# Altium project My_First_PCB_Project.PrjPcb (part 1 of 4)
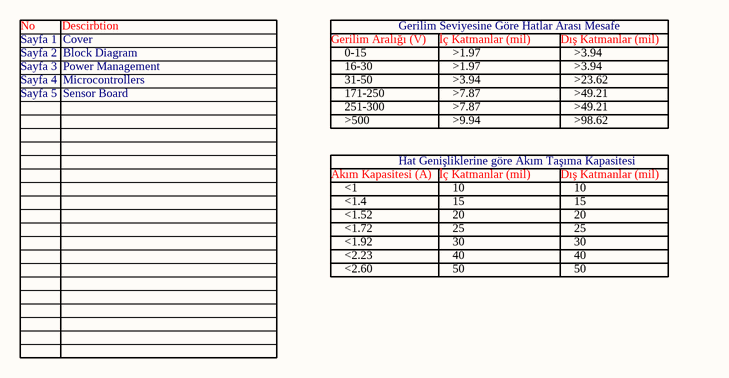
[diagram p0: Cover.SchDoc]
5 sheets, 126 parts. Net scope: flat (ports and power ports of the same name join across sheets).
Board file: Myfirstpcbproject.PcbDoc
Sheets:
  Cover.SchDoc
  Block_Diagram.SchDoc
  Power management.SchDoc
  Microcontrollerr.SchDoc
  Sensor Board.SchDoc

## Sheet Cover.SchDoc
size A4; SheetNumber: 1; SheetTotal: 5

### Notes on the sheet
- Sayfa 1  Cover
- No         Descirbtion
- Gerilim Aralığı (V)
- Gerilim Seviyesine Göre Hatlar Arası Mesafe
- İç Katmanlar (mil)
- Dış Katmanlar (mil)
- Sayfa 2  Block Diagram
- Sayfa 3  Power Management
- Sayfa 4  Microcontrollers
- Sayfa 5  Sensor Board
- 0-15
- 16-30
- 31-50
- 171-250
- 251-300
- >7.87
- >3.94
- >1.97
- >23.62
- >49.21
- Akım Kapasitesi (A)
- >500
- Hat Genişliklerine göre Akım Taşıma Kapasitesi
- >9.94
- >98.62
- <1
- <1.4
- <1.52
- <1.72
- <1.92
- 10
- 15
- 20
- 25
- 30
- <2.23
- <2.60
- 40
- 50

## Sheet Block_Diagram.SchDoc
size A4; Date: 20.10.2024; Author: ismet akalın; DrawnBy: ismet akalın; SheetNumber: 2; SheetTotal: 5
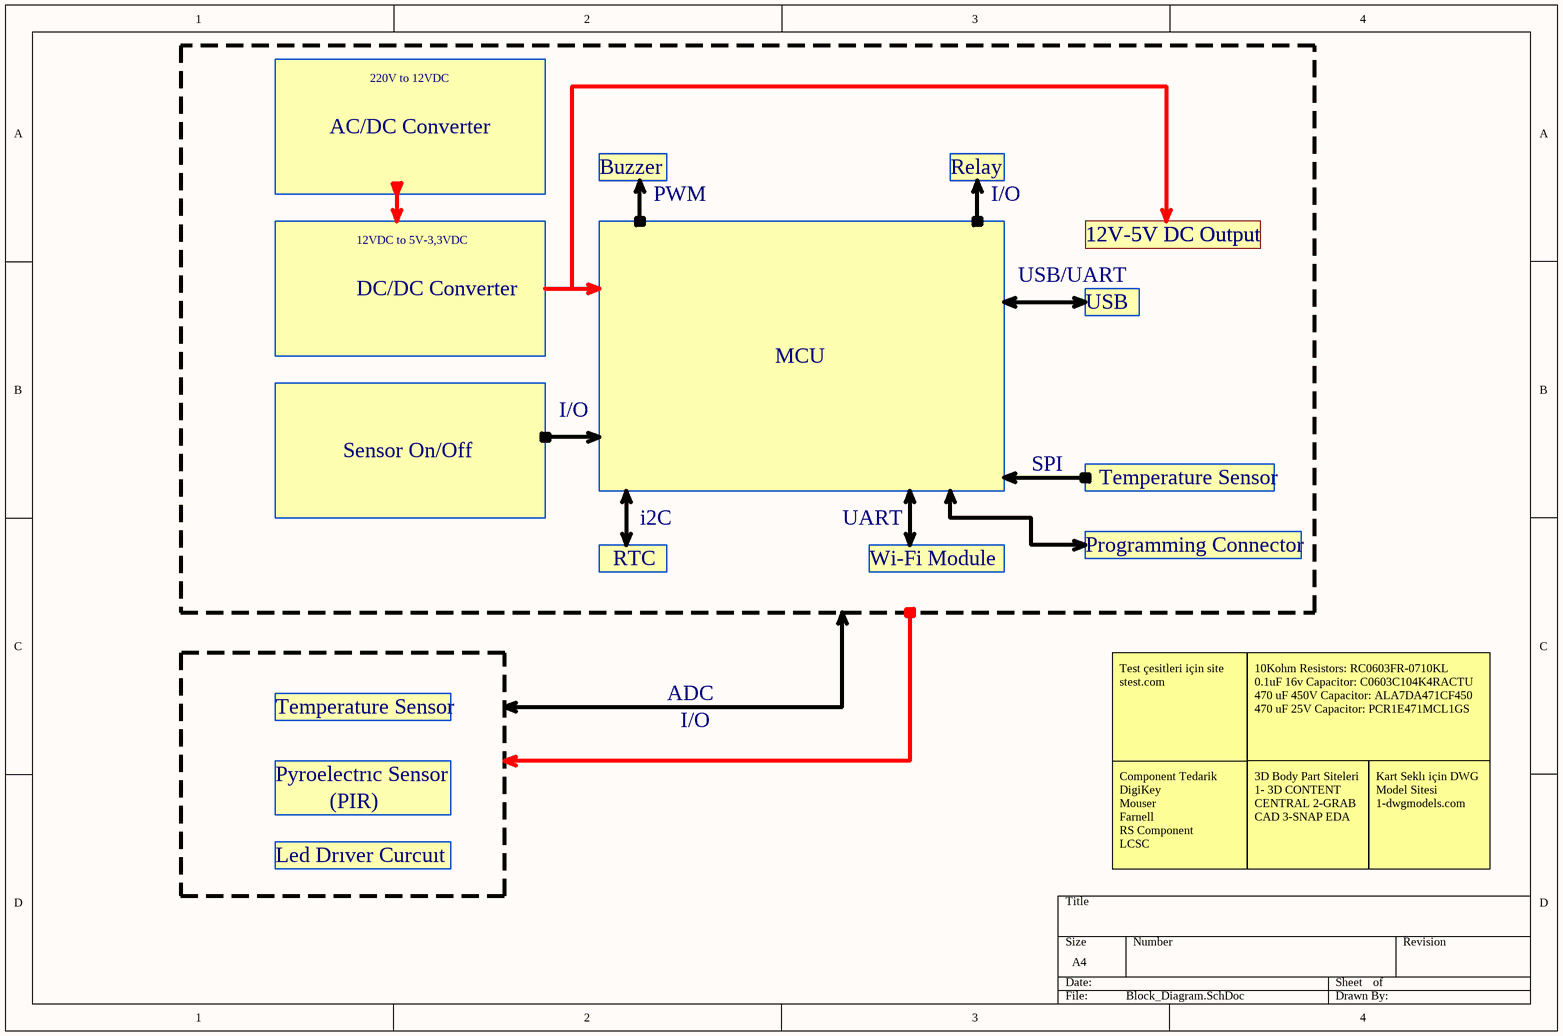
[diagram p1: Block_Diagram.SchDoc]

### Notes on the sheet
- 220V to 12VDC
- AC/DC Converter
- Buzzer
- Relay
- 12VDC to 5V-3,3VDC
- PWM
- I/O
- 12V-5V DC Output
- DC/DC Converter
- USB/UART
- USB
- MCU
- Sensor On/Off
- SPI
- Temperature Sensor
- RTC
- i2C
- UART
- Wi-Fi Module
- Programming Connector
- ADC
- Pyroelectrıc Sensor
- Test çesitleri için site         stest.com
- 10Kohm Resistors: RC0603FR-0710KL
  0.1uF 16v Capacitor: C0603C104K4RACTU
  470 uF 450V Capacitor: ALA7DA471CF450
  470 uF 25V Capacitor: PCR1E471MCL1GS
- (PIR)
- Led Drıver Curcuıt
- Component Tedarik
  DigiKey
  Mouser
  Farnell
  RS Component
  LCSC
- 3D Body Part Siteleri  1- 3D CONTENT CENTRAL 2-GRAB CAD 3-SNAP EDA
- Kart Seklı için DWG Model Sitesi 1-dwgmodels.com